# EAGLE design Power Supply (EAGLE 5.06)
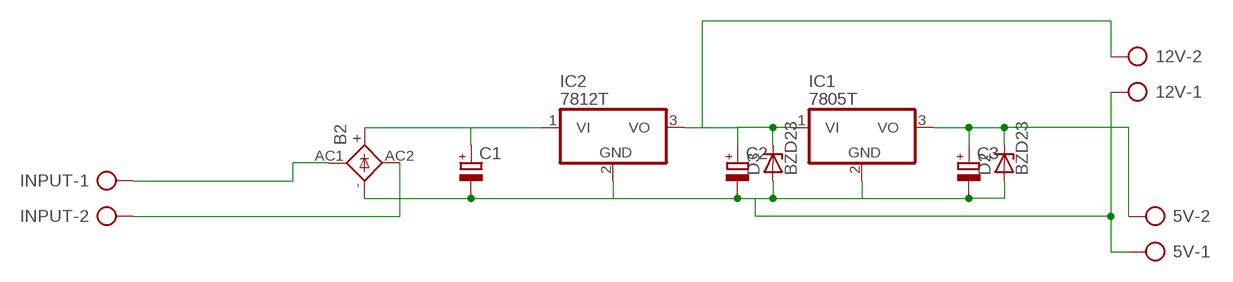
[diagram p0: schematic, sheet 1]

## Parts
5V  AK300/2  [AK300/2]
12V  AK300/2  [AK300/2]
B2  1KAB  [1KAB]
C1  CPOL-EUE5-13  [E5-13]
C2  CPOL-EUE5-13  [E5-13]
C3  CPOL-EUE5-13  [E5-13]
D2  BZD23  [SOD81]
D3  BZD23  [SOD81]
IC1  7805T  [TO220H]
IC2  7812T  [TO220H]
INPUT  AK300/2  [AK300/2]

## Nets
N$1: 5V.1 12V.1 B2.- C1.- C2.- C3.- D2.A D3.A IC1.2(GND) IC2.2(GND)
N$2: B2.+ C1.+ IC2.1(VI)
N$3: 12V.2 C2.+ D3.C IC1.1(VI) IC2.3(VO)
N$5: B2.AC2 INPUT.2
N$6: B2.AC1 INPUT.1
N$7: 5V.2 C3.+ D2.C IC1.3(VO)

## Library data of the parts
5V 12V INPUT = con-ptr500:AK300/2: CONNECTOR
B2 = rectifier:1KAB: RECTIFIER grid 5,08 x 5,08 mm
C1-C3 = qfm-trx1-24g:CPOL-EU: POLARIZED CAPACITOR, European symbol
D2 D3 = diode:BZD23: Z DIODE
IC1 IC2 = linear:78*: Positive VOLTAGE REGULATOR Source: http://cache.national.com/ds/LM/LM78L05.pdf http://www.fairchildsemi.com/ds/LM/LM7805.pdf

## Board
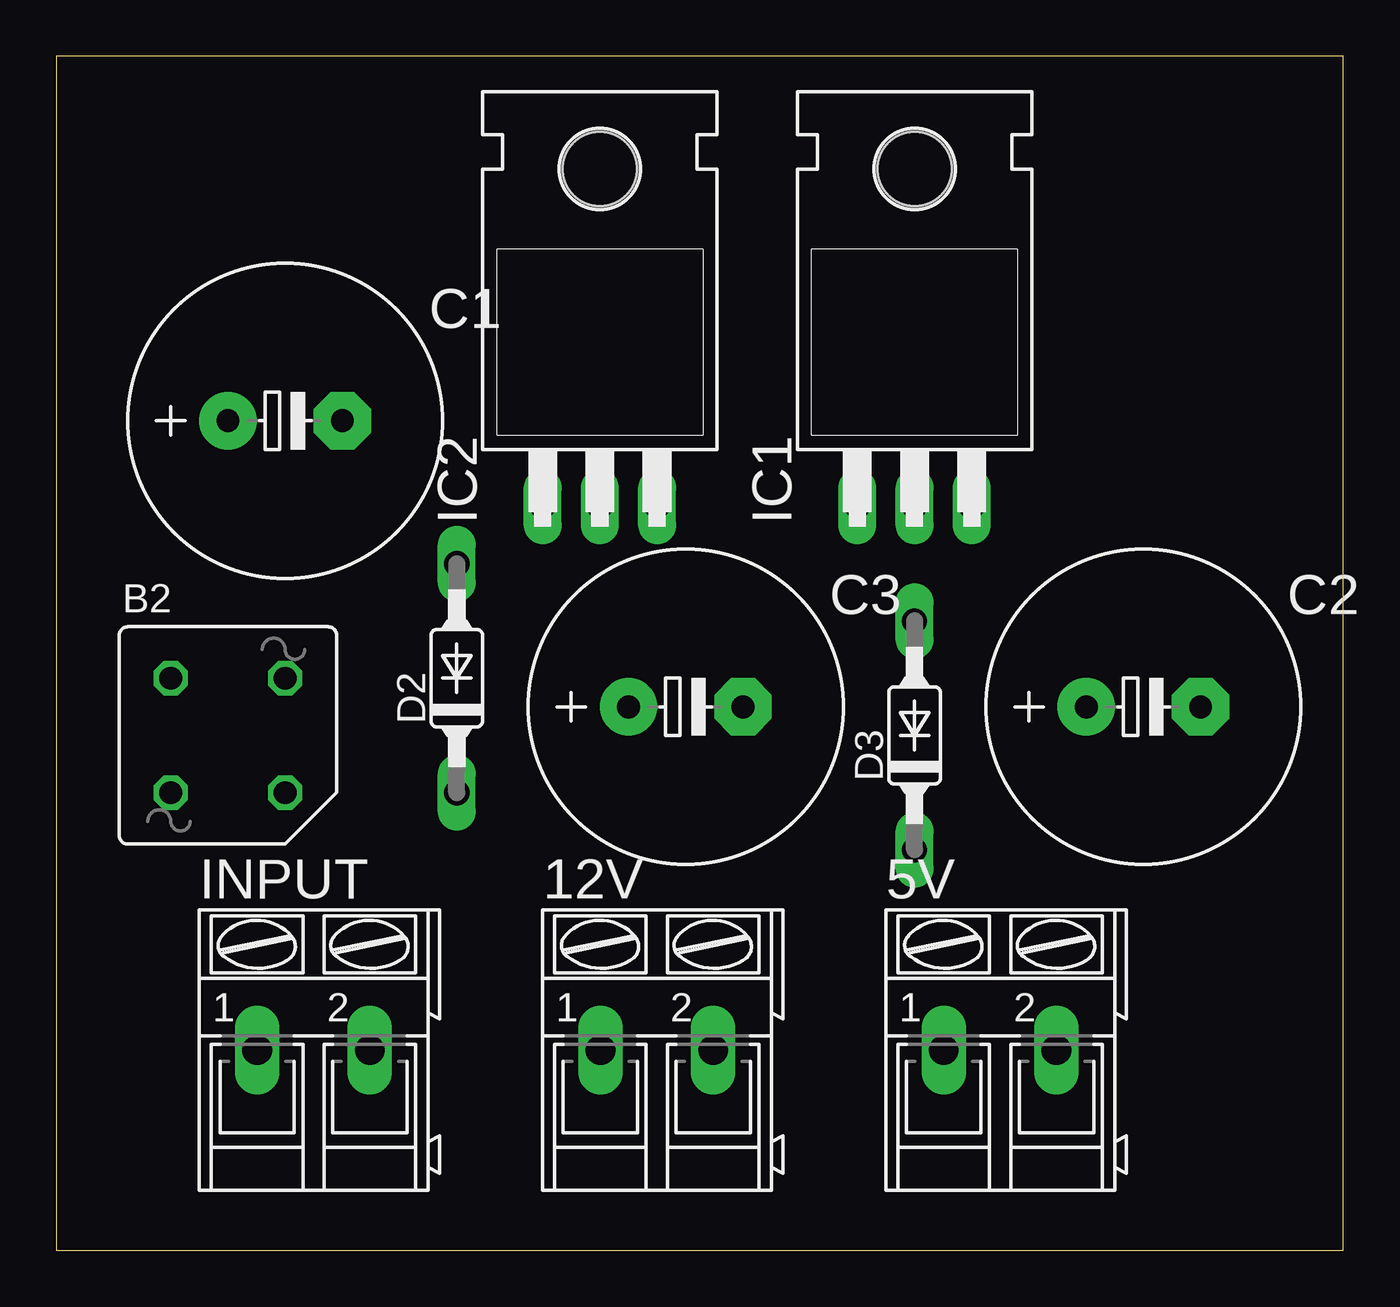
[diagram p1: board, top side]
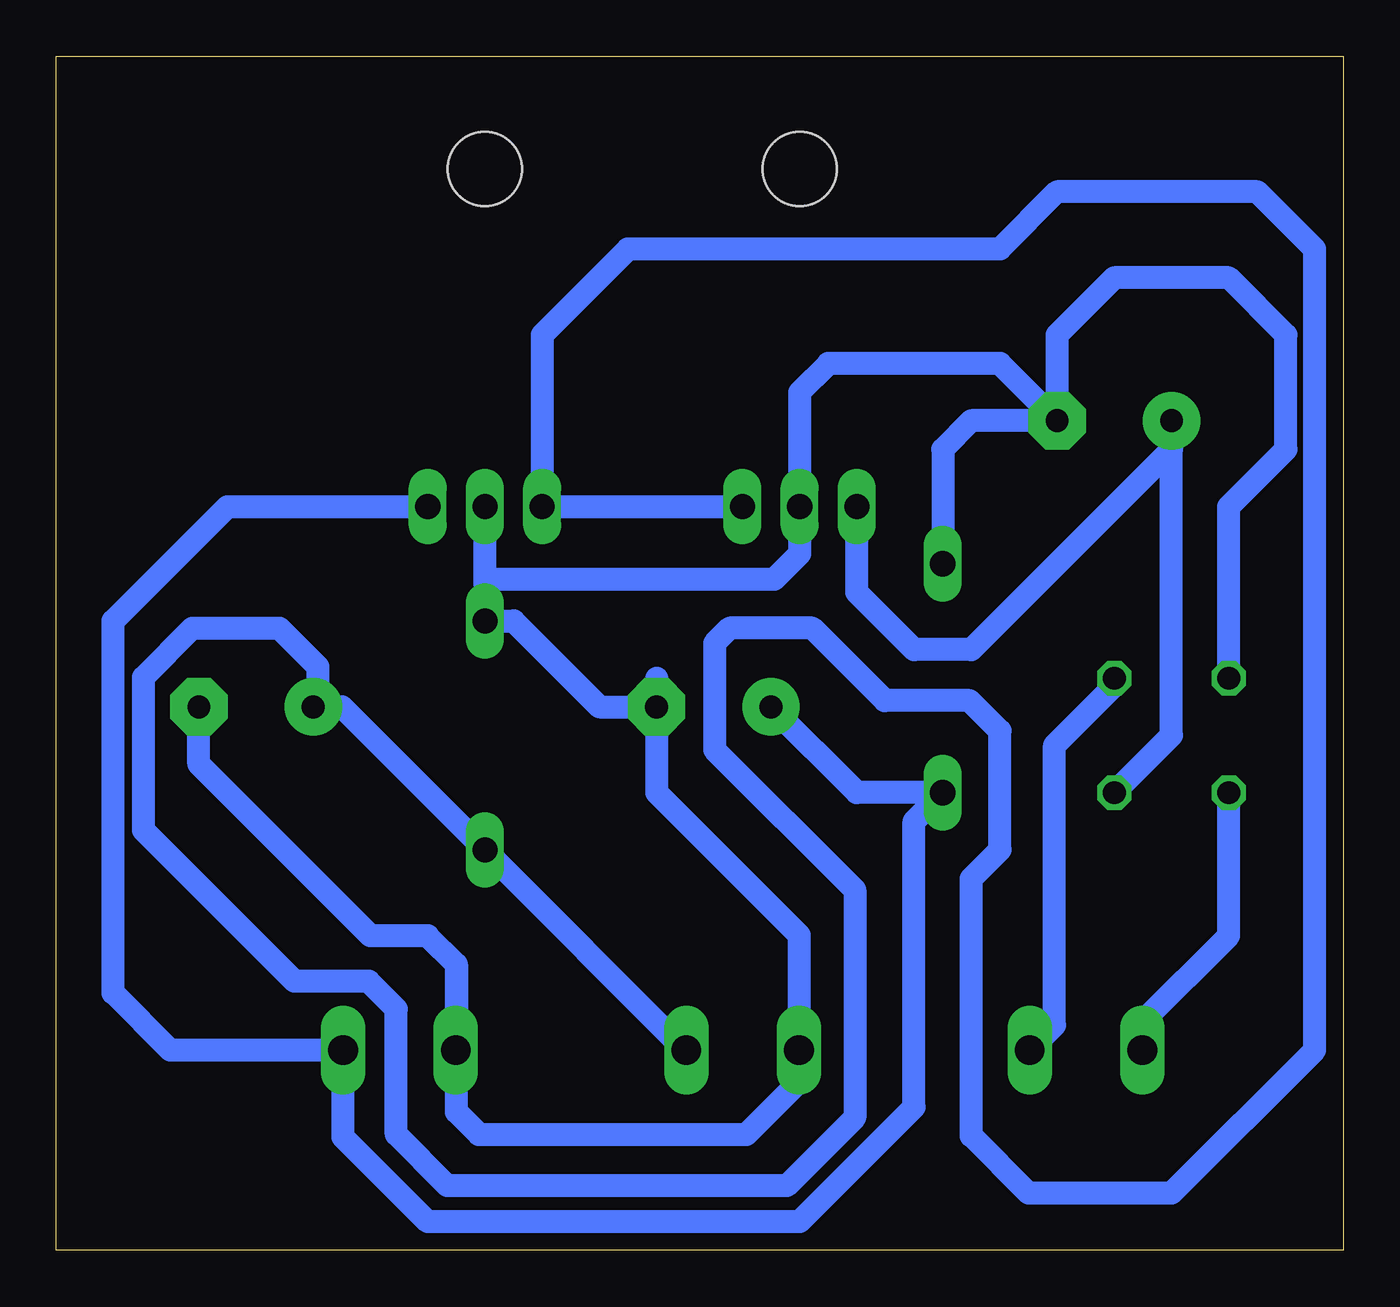
[diagram p2: board, bottom side, seen from below]

Size 57.13 x 53.01 mm. Coordinates in mm from the lower left corner, seen from the top.
Outline: 0,0 57.13,0 57.13,53.01 0,53.01 0,0
Copper layers (1*16): Top 0.035mm / dielectric 1.5mm / Bottom 0.035mm
Design rules "default": minimum track width 10mil, minimum drill 24mil, track to track 8mil, track to pad 8mil, pad to pad 8mil, via to via 8mil, smd to smd 8mil, copper to edge 40mil, drill to drill 8mil, minimum pad ring 10mil, minimum via ring 8mil, stop-mask expansion 4mil, vias tented up to drill 0mil, thermal gap 10mil

### Footprints (pad centres in the part's own frame; a part is rotated, then mirrored left to right if it is on the bottom)
AK300/2 = drill 1.321 long: 1 -2.515,0; 2 2.489,0
1KAB = drill 1.016 octagon: + 2.54,-2.54; - -2.54,2.54; AC1 -2.54,-2.54; AC2 2.54,2.54
E5-13 = drill 1.016 pad 2.54 round: + -2.54,0 | drill 1.016 pad 2.54 octagon: - 2.54,0
SOD81 = drill 1.118 long: A 5.08,0; C -5.08,0
TO220H = drill 1.118 long: 1 -2.54,-10.16; 2 0,-10.16; 3 2.54,-10.16 | hole 3.302: 0,4.826

### Placement (x,y rotation side)
5V  41.91,8.89 0 top
12V  26.67,8.89 0 top
B2  7.62,22.86 0 top
C1  10.16,36.83 0 top
C2  48.26,24.13 0 top
C3  27.94,24.13 0 top
D2  17.78,25.4 90 top
D3  38.1,22.86 90 top
IC1  38.1,43.18 0 top
IC2  24.13,43.18 0 top
INPUT  11.43,8.89 0 top

### Tracks (layer width: path | path; a pad name or v marks a point on that pad's centre or on a via)
N$1
  Bottom 1.016: B2.- 5.08,33.02 2.54,35.56 2.54,40.64 5.08,43.18 10.16,43.18 12.7,40.64 C1.- | C1.- 16.51,36.83 17.78,35.56 D2.A | C1.- 15.24,39.37 22.86,39.37 24.13,38.1 IC2.2 24.13,30.92 25.26,29.79 37.91,29.79 38.1,29.6 | 38.1,29.6 D3.A 36.83,27.94 33.02,24.13 C3.- | 38.1,29.6 IC1.2 | C3.- 30.48,20.32 24.16,13.99 12V.1 24.23,8.82 24.23,7.41 26.49,5.14 38.36,5.14 39.37,6.15 39.37,12.7 | C2.- 50.8,21.59 43.18,13.97 40.64,13.97 39.37,12.7 | 39.37,12.7 39.37,8.91 5V.1 | C3.- 30.48,25.4
N$2
  Bottom 1.016: B2.+ 7.62,22.86 C1.+ 7.62,35.56 16.51,26.67 19.05,26.67 21.59,29.21 IC2.1
N$3
  Bottom 1.016: IC2.3 IC1.1 35.56,40.64 31.75,44.45 15.24,44.45 12.7,46.99 3.81,46.99 1.27,44.45 1.27,8.89 7.62,2.54 13.97,2.54 16.51,5.08 16.51,16.51 15.24,17.78 15.24,23.06 16.59,24.41 20.35,24.41 23.57,27.62 27.24,27.62 27.9,26.96 27.9,22.22 21.68,16 21.68,5.89 24.7,2.88 39.77,2.88 42.04,5.14 42.04,10.72 43.27,11.94 46.55,11.94 53.26,18.65 53.26,25.45 51.09,27.62 47.23,27.62 45.53,25.92 45.53,24.32 C2.+ 44.45,24.13 D3.C 29.21,8.89 12V.2
N$5
  Bottom 1.016: 13.97,8.94 INPUT.2 12.82,9.99 12.82,22.43 10.16,25.09 B2.AC2
N$6
  Bottom 1.016: INPUT.1 8.91,10.13 5.08,13.97 B2.AC1
N$7
  Bottom 1.016: IC1.3 49.53,33.02 54.61,27.94 54.61,11.43 52.07,8.89 5V.2 44.4,5.03 40.64,1.27 24.13,1.27 19.05,6.35 19.05,19.05 D2.C 21.59,20.32 C3.+